# EAGLE design Led ControllerV2fixed (EAGLE 9.4.2)
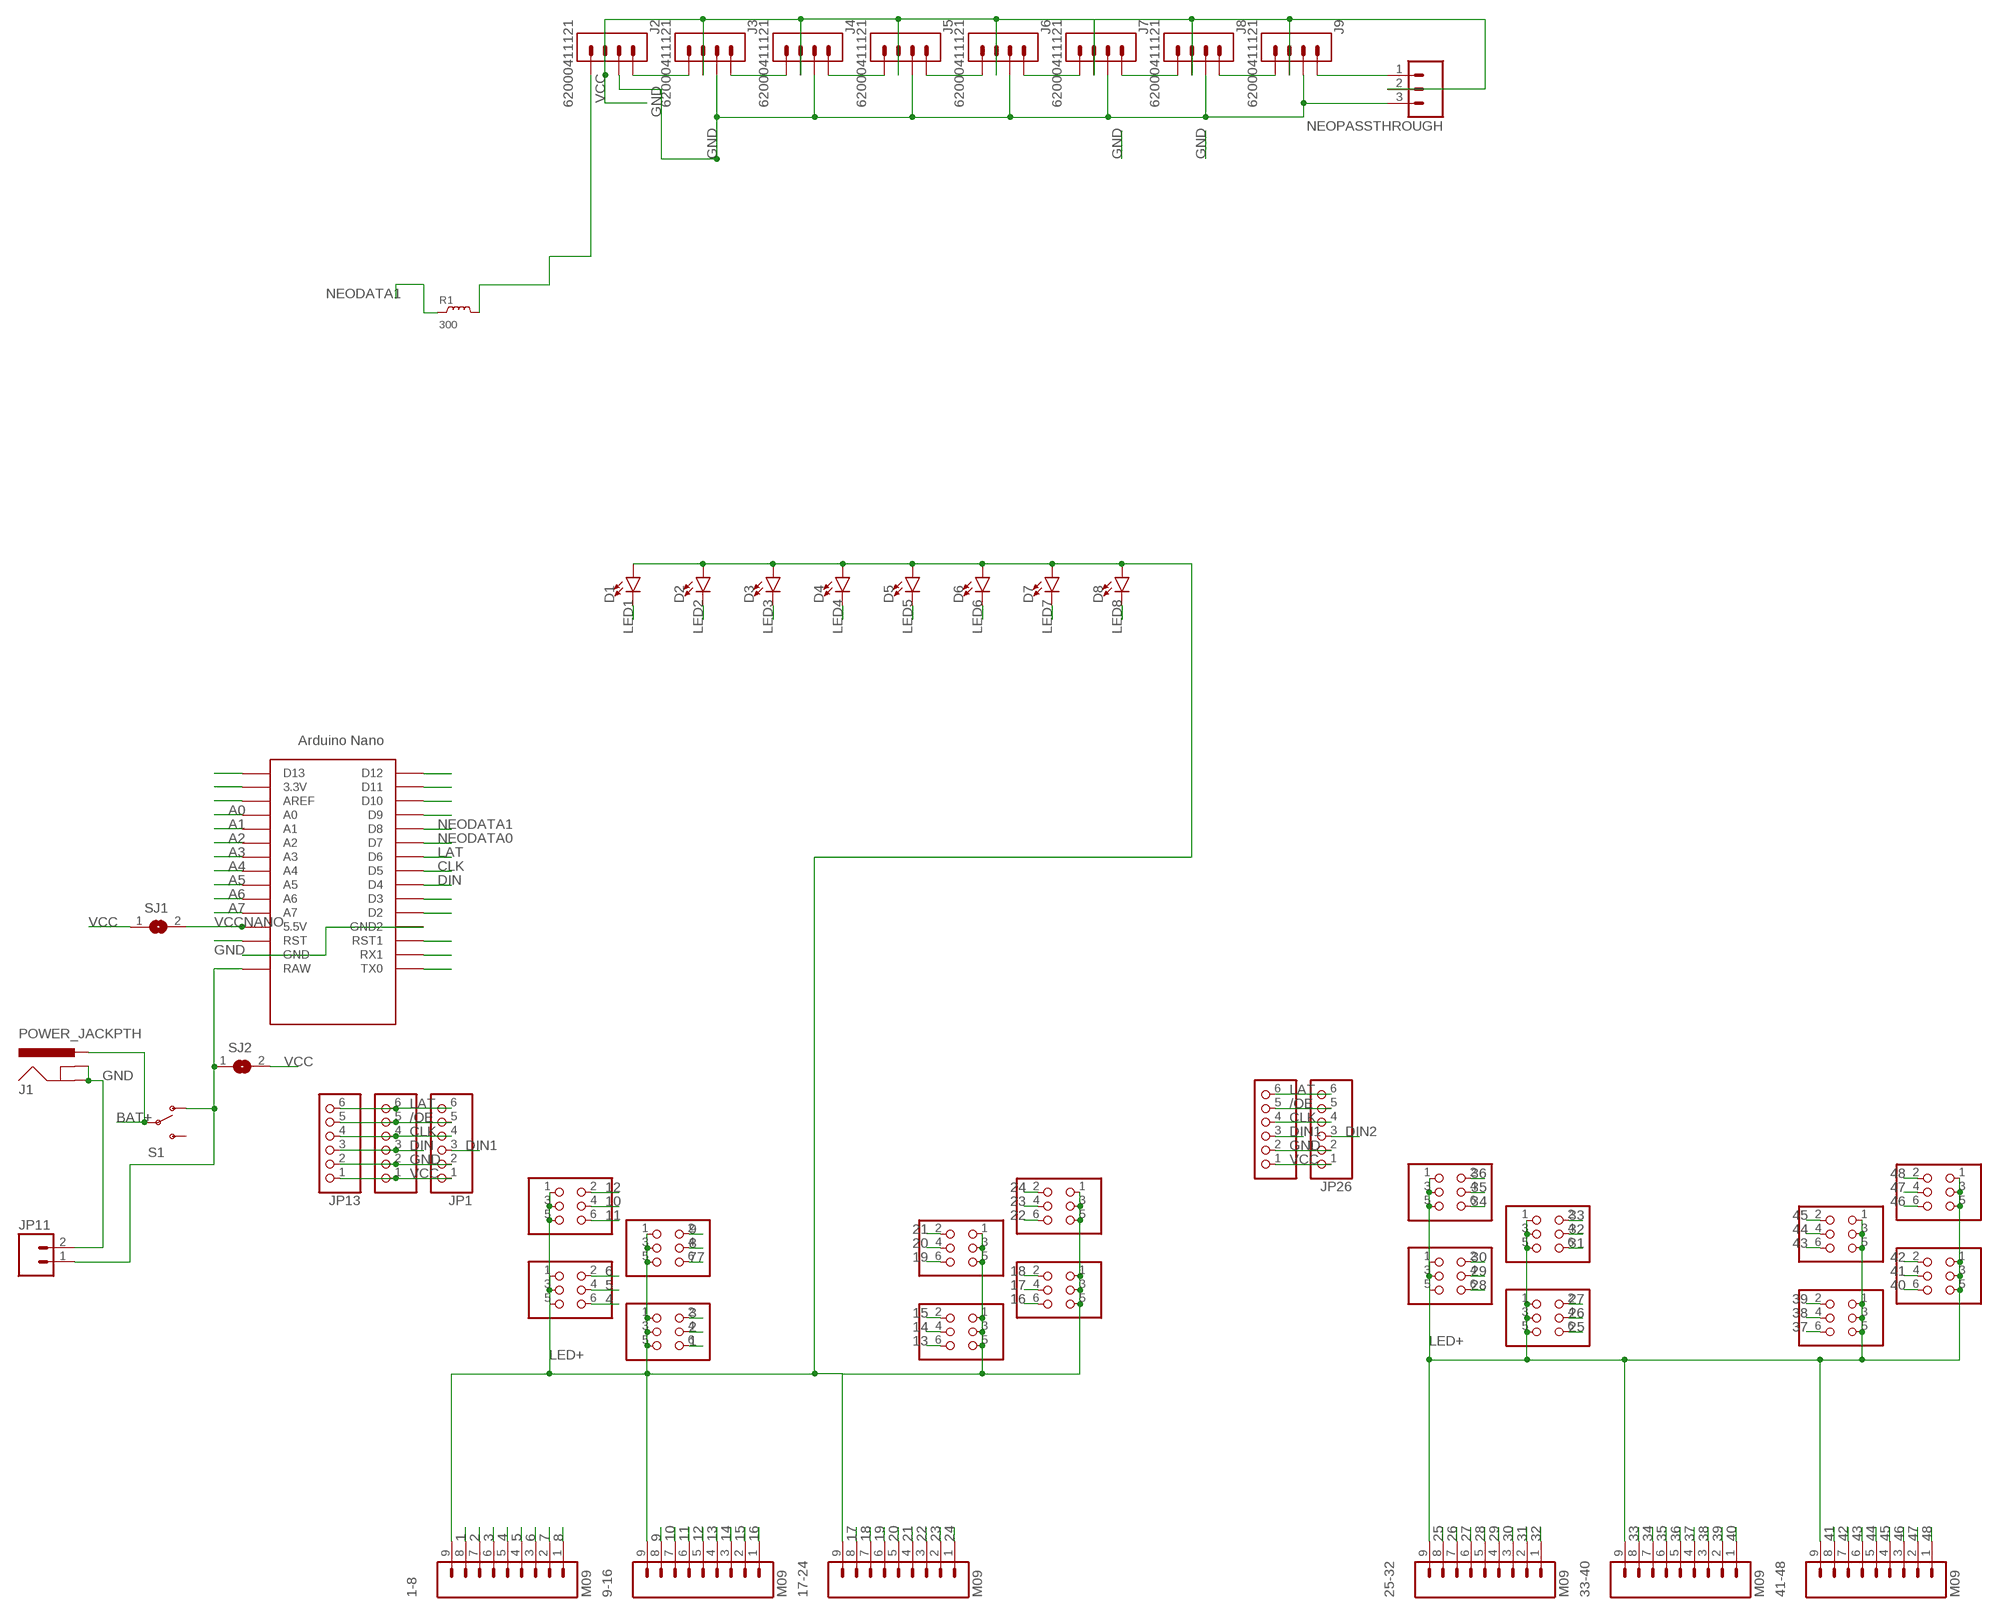
[diagram p0: schematic, sheet 1, part 1 of 2]
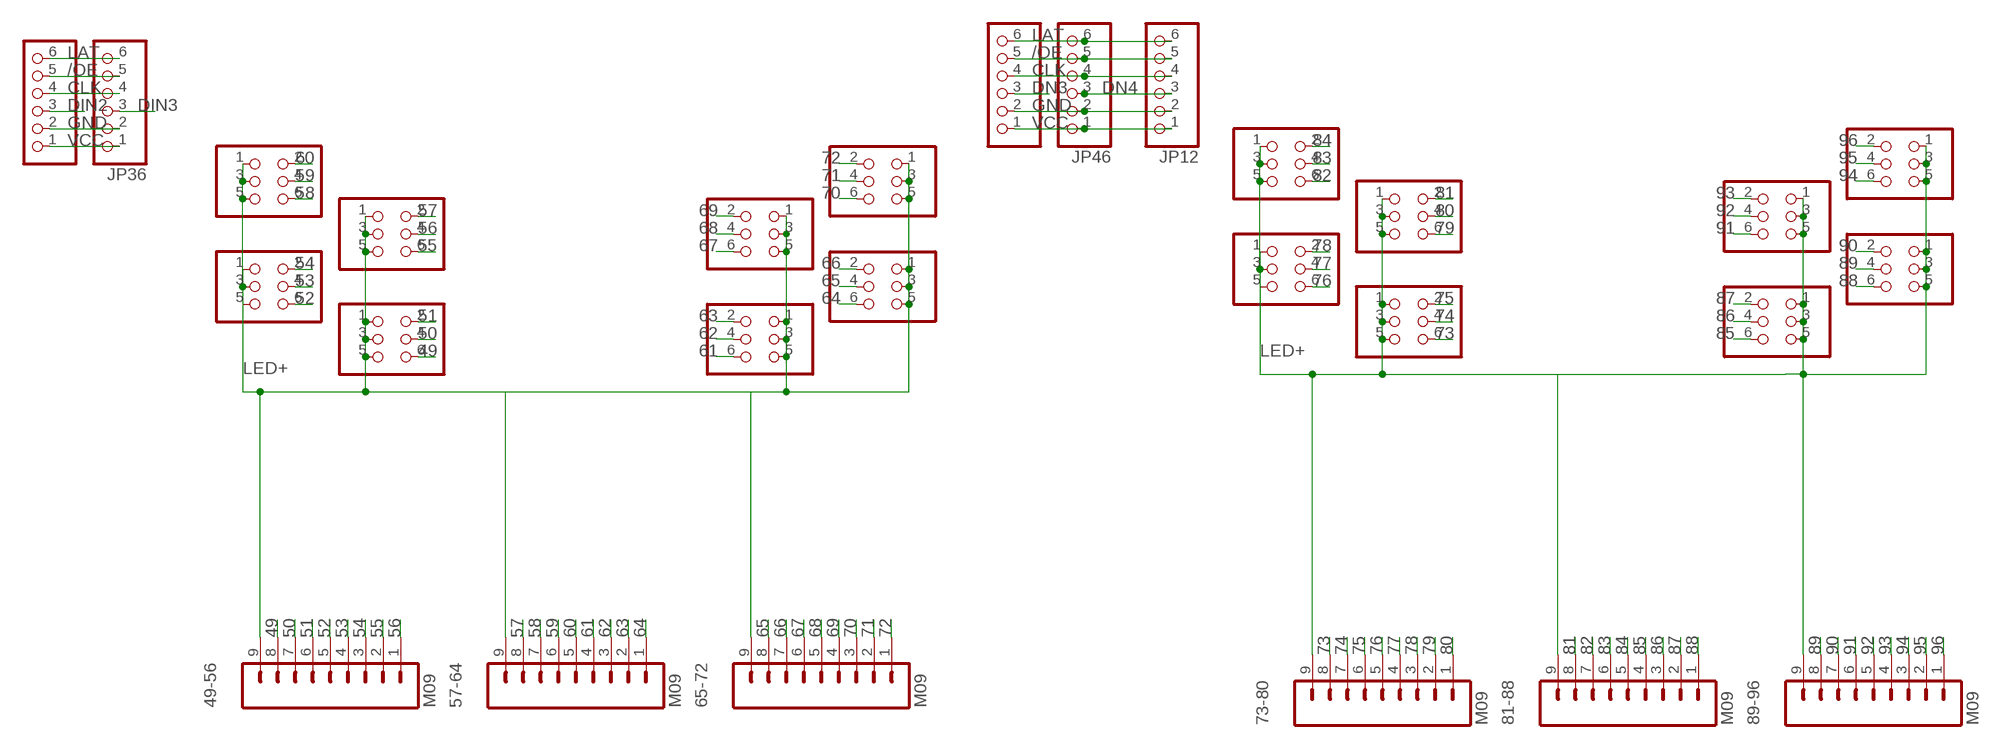
[diagram p1: schematic, sheet 1, part 2 of 2]

## Parts
1-8  M09  [1X09]
9-16  M09  [1X09]
17-24  M09  [1X09]
25-32  M09  [1X09]
33-40  M09  [1X09]
41-48  M09  [1X09]
49-56  M09  [1X09]
57-64  M09  [1X09]
65-72  M09  [1X09]
73-80  M09  [1X09]
81-88  M09  [1X09]
89-96  M09  [1X09]
D1  LED5MM  [LED_5MM]
D2  LED5MM  [LED_5MM]
D3  LED5MM  [LED_5MM]
D4  LED5MM  [LED_5MM]
D5  LED5MM  [LED_5MM]
D6  LED5MM  [LED_5MM]
D7  LED5MM  [LED_5MM]
D8  LED5MM  [LED_5MM]
J1  POWER_JACKPTH  [POWER_JACK_PTH]
J2  62000411121  [62000411121]
J3  62000411121  [62000411121]
J4  62000411121  [62000411121]
J5  62000411121  [62000411121]
J6  62000411121  [62000411121]
J7  62000411121  [62000411121]
J8  62000411121  [62000411121]
J9  62000411121  [62000411121]
JP1  INPUT  PINHD-1X6CB  [1X06-CLEANBIG]
JP2  HEADER-2X3  [2X03_ROUND_70MIL]
JP3  HEADER-2X3  [2X03_ROUND_70MIL]
JP4  HEADER-2X3  [2X03_ROUND_70MIL]
JP5  HEADER-2X3  [2X03_ROUND_70MIL]
JP6  HEADER-2X3  [2X03_ROUND_70MIL]
JP7  HEADER-2X3  [2X03_ROUND_70MIL]
JP8  HEADER-2X3  [2X03_ROUND_70MIL]
JP9  HEADER-2X3  [2X03_ROUND_70MIL]
JP10  OUTPUT  PINHD-1X6CB  [1X06-CLEANBIG]
JP11  M02POLAR  [MOLEX-1X2]
JP12  INPUT  PINHD-1X6CB  [1X06-CLEANBIG]
JP13  INPUT  PINHD-1X6CB  [1X06-CLEANBIG]
JP22  HEADER-2X3  [2X03_ROUND_70MIL]
JP23  HEADER-2X3  [2X03_ROUND_70MIL]
JP24  HEADER-2X3  [2X03_ROUND_70MIL]
JP25  HEADER-2X3  [2X03_ROUND_70MIL]
JP26  INPUT  PINHD-1X6CB  [1X06-CLEANBIG]
JP27  OUTPUT  PINHD-1X6CB  [1X06-CLEANBIG]
JP28  HEADER-2X3  [2X03_ROUND_70MIL]
JP29  HEADER-2X3  [2X03_ROUND_70MIL]
JP30  HEADER-2X3  [2X03_ROUND_70MIL]
JP31  HEADER-2X3  [2X03_ROUND_70MIL]
JP32  HEADER-2X3  [2X03_ROUND_70MIL]
JP33  HEADER-2X3  [2X03_ROUND_70MIL]
JP34  HEADER-2X3  [2X03_ROUND_70MIL]
JP35  HEADER-2X3  [2X03_ROUND_70MIL]
JP36  INPUT  PINHD-1X6CB  [1X06-CLEANBIG]
JP37  OUTPUT  PINHD-1X6CB  [1X06-CLEANBIG]
JP38  HEADER-2X3  [2X03_ROUND_70MIL]
JP39  HEADER-2X3  [2X03_ROUND_70MIL]
JP40  HEADER-2X3  [2X03_ROUND_70MIL]
JP41  HEADER-2X3  [2X03_ROUND_70MIL]
JP42  HEADER-2X3  [2X03_ROUND_70MIL]
JP43  HEADER-2X3  [2X03_ROUND_70MIL]
JP44  HEADER-2X3  [2X03_ROUND_70MIL]
JP45  HEADER-2X3  [2X03_ROUND_70MIL]
JP46  INPUT  PINHD-1X6CB  [1X06-CLEANBIG]
JP47  OUTPUT  PINHD-1X6CB  [1X06-CLEANBIG]
JP48  HEADER-2X3  [2X03_ROUND_70MIL]
JP49  HEADER-2X3  [2X03_ROUND_70MIL]
JP50  HEADER-2X3  [2X03_ROUND_70MIL]
JP51  HEADER-2X3  [2X03_ROUND_70MIL]
NEOPASSTHROUGH  M03PTH  [1X03]
R1  300  COIL-AXL-REGULAR  [AXL-REGULAR]
S1  SWITCH-SPSTPTH  [SWITCH-SPDT]
SJ1  JUMPER  [SJW]
SJ2  JUMPER  [SJW]
U$1  NANO  [NANO]

## Nets
1: 1-8.8 JP5.6
2: 1-8.7 JP5.4
3: 1-8.6 JP5.2
4: 1-8.5 JP4.6
5: 1-8.4 JP4.4
6: 1-8.3 JP4.2
7: 1-8.2
8: 1-8.1 JP3.4
9: 9-16.8 JP3.2
10: 9-16.7 JP2.4
11: 9-16.6 JP2.6
12: 9-16.5 JP2.2
13: 9-16.4 JP9.6
14: 9-16.3 JP9.4
15: 9-16.2 JP9.2
16: 9-16.1 JP8.6
17: 17-24.8 JP8.4
18: 17-24.7 JP8.2
19: 17-24.6 JP7.6
20: 17-24.5 JP7.4
21: 17-24.4 JP7.2
22: 17-24.3 JP6.6
23: 17-24.2 JP6.4
24: 17-24.1 JP6.2
25: 25-32.8 JP25.6
26: 25-32.7 JP25.4
27: 25-32.6 JP25.2
28: 25-32.5 JP24.6
29: 25-32.4 JP24.4
30: 25-32.3 JP24.2
31: 25-32.2 JP23.6
32: 25-32.1 JP23.4
33: 33-40.8 JP23.2
34: 33-40.7 JP22.6
35: 33-40.6 JP22.4
36: 33-40.5 JP22.2
37: 33-40.4 JP31.6
38: 33-40.3 JP31.4
39: 33-40.2 JP31.2
40: 33-40.1 JP30.6
41: 41-48.8 JP30.4
42: 41-48.7 JP30.2
43: 41-48.6 JP29.6
44: 41-48.5 JP29.4
45: 41-48.4 JP29.2
46: 41-48.3 JP28.6
47: 41-48.2 JP28.4
48: 41-48.1 JP28.2
49: 49-56.8 JP35.6
50: 49-56.7 JP35.4
51: 49-56.6 JP35.2
52: 49-56.5 JP34.6
53: 49-56.4 JP34.4
54: 49-56.3 JP34.2
55: 49-56.2 JP33.6
56: 49-56.1 JP33.4
57: 57-64.8 JP33.2
58: 57-64.7 JP32.6
59: 57-64.6 JP32.4
60: 57-64.5 JP32.2
61: 57-64.4 JP41.6
62: 57-64.3 JP41.4
63: 57-64.2 JP41.2
64: 57-64.1 JP40.6
65: 65-72.8 JP40.4
66: 65-72.7 JP40.2
67: 65-72.6 JP39.6
68: 65-72.5 JP39.4
69: 65-72.4 JP39.2
70: 65-72.3 JP38.6
71: 65-72.2 JP38.4
72: 65-72.1 JP38.2
73: 73-80.8 JP45.6
74: 73-80.7 JP45.4
75: 73-80.6 JP45.2
76: 73-80.5 JP44.6
77: 73-80.4 JP3.6 JP44.4
78: 73-80.3 JP44.2
79: 73-80.2 JP43.6
80: 73-80.1 JP43.4
81: 81-88.8 JP43.2
82: 81-88.7 JP42.6
83: 81-88.6 JP42.4
84: 81-88.5 JP42.2
85: 81-88.4 JP51.6
86: 81-88.3 JP51.4
87: 81-88.2 JP51.2
88: 81-88.1 JP50.6
89: 89-96.8 JP50.4
90: 89-96.7 JP50.2
91: 89-96.6 JP49.6
92: 89-96.5 JP49.4
93: 89-96.4 JP49.2
94: 89-96.3 JP48.6
95: 89-96.2 JP48.4
96: 89-96.1 JP48.2
/OE: JP1.5 JP10.5 JP12.5 JP13.5 JP26.5 JP27.5 JP36.5 JP37.5 JP46.5 JP47.5
A0: U$1.A0
A1: U$1.A1
A2: U$1.A2
A3: U$1.A3
A4: U$1.A4
A5: U$1.A5
A6: U$1.A6
A7: U$1.A7
BAT+: J1.PWR S1.2(P)
CLK: JP1.4 JP10.4 JP12.4 JP13.4 JP26.4 JP27.4 JP36.4 JP37.4 JP46.4 JP47.4 U$1.D5
DATAIN: J2.4 R1.2
DIN: JP10.3 JP13.3 U$1.D4
DIN1: JP1.3 JP27.3
DIN2: JP26.3 JP37.3
DIN3: JP36.3
DN3: JP47.3
DN4: JP12.3 JP46.3
GND: J1.GND J1.GNDBREAK J2.2 J3.2 J4.2 J5.2 J6.2 J7.2 J8.2 J9.2 JP1.2 JP10.2 JP11.2 JP12.2 JP13.2 JP26.2 JP27.2 JP36.2 JP37.2 JP46.2 JP47.2 NEOPASSTHROUGH.3 U$1.GND U$1.GND1(GND2)
LAT: JP1.6 JP10.6 JP12.6 JP13.6 JP26.6 JP27.6 JP36.6 JP37.6 JP46.6 JP47.6 U$1.D6
LED1: D1.K(C)
LED2: D2.K(C)
LED3: D3.K(C)
LED4: D4.K(C)
LED5: D5.K(C)
LED6: D6.K(C)
LED7: D7.K(C)
LED8: D8.K(C)
LED+: 1-8.9 9-16.9 17-24.9 25-32.9 33-40.9 41-48.9 49-56.9 57-64.9 65-72.9 73-80.9 81-88.9 89-96.9 D1.A D2.A D3.A D4.A D5.A D6.A D7.A D8.A JP2.1 JP2.3 JP2.5 JP3.1 JP3.3 JP3.5 JP4.1 JP4.3 JP4.5 JP5.1 JP5.3 JP5.5 JP6.1 JP6.3 JP6.5 JP7.1 JP7.3 JP7.5 JP8.1 JP8.3 JP8.5 JP9.1 JP9.3 JP9.5 JP22.1 JP22.3 JP22.5 JP23.1 JP23.3 JP23.5 JP24.1 JP24.3 JP24.5 JP25.1 JP25.3 JP25.5 JP28.1 JP28.3 JP28.5 JP29.1 JP29.3 JP29.5 JP30.1 JP30.3 JP30.5 JP31.1 JP31.3 JP31.5 JP32.1 JP32.3 JP32.5 JP33.1 JP33.3 JP33.5 JP34.1 JP34.3 JP34.5 JP35.1 JP35.3 JP35.5 JP38.1 JP38.3 JP38.5 JP39.1 JP39.3 JP39.5 JP40.1 JP40.3 JP40.5 JP41.1 JP41.3 JP41.5 JP42.1 JP42.3 JP42.5 JP43.1 JP43.3 JP43.5 JP44.1 JP44.3 JP44.5 JP45.1 JP45.3 JP45.5 JP48.1 JP48.3 JP48.5 JP49.1 JP49.3 JP49.5 JP50.1 JP50.3 JP50.5 JP51.1 JP51.3 JP51.5
N$1: JP11.1 S1.1(O) SJ2.1 U$1.RAW
N$2: U$1.RST
N$4: J9.1 NEOPASSTHROUGH.1
N$11: U$1.AREF
N$12: U$1.3.3V
N$13: U$1.D13
N$14: U$1.D12
N$15: U$1.D11
N$16: U$1.D10
N$17: U$1.D9
N$23: U$1.D3
N$24: U$1.D2
N$25: U$1.RST1
N$26: U$1.RX1
N$27: U$1.TX0
N$30: J2.1 J3.4
N$31: J3.1 J4.4
N$32: J4.1 J5.4
N$34: J5.1 J6.4
N$35: J6.1 J7.4
N$36: J7.1 J8.4
N$37: J8.1 J9.4
NEODATA0: U$1.D7
NEODATA1: R1.1 U$1.D8
VCC: J2.3 J3.3 J4.3 J5.3 J6.3 J7.3 J8.3 J9.3 JP1.1 JP10.1 JP12.1 JP13.1 JP26.1 JP27.1 JP36.1 JP37.1 JP46.1 JP47.1 NEOPASSTHROUGH.2 SJ1.1 SJ2.2
VCCNANO: SJ1.2 U$1.5V(5.5V)
Unconnected: S1.3(S) U$1.ICSP1 U$1.ICSP2 U$1.ICSP3 U$1.ICSP4 U$1.ICSP5 U$1.ICSP6

## Library data of the parts
1-8 9-16 17-24 25-32 33-40 41-48 49-56 57-64 65-72 73-80 81-88 89-96 = SparkFun:M09: Header 9 Standard 9-pin 0.1" header. Use with straight break away headers (SKU : PRT-00116), right angle break away headers (PRT-00553), swiss pins (PRT-00743), machine pins (PRT-00117), and female headers (PRT-00115).
D1-D8 = SparkFun-LED:LED: LED (Generic) Standard schematic elements and footprints for 5mm, 3mm, 1206, and 0603 sized LEDs. Generic LEDs with no color specified.
J1 = SparkFun:POWER_JACK: Power Jack This is the standard 5.5mm barrel jack for power. The PTH is the most common, proven, reliable, footprint. All others are experimental. The Slot footprint only works if the mill layer is transmitted to the PCB fab house so be warned. Spark Fun Electronics SKU : PRT-00119. Mating wall wart : TOL-00298 (and others); MPN: RAPC712BK; OC_NEWARK: 03M4244
J2-J9 = Headers:62000411121: THT Vertical Pin Header WR-PHD, Pitch 2.00 mm, Single Row, 4 pins Manufacturer's datasheet <https://datasheet.octopart.com/62000411121-W%C3%BCrth-Elektronik-datasheet-117282003.pdf>; CREATED_BY: PCBLayout.com; MANUFACTURER: Würth Elektronik; OC_NEWARK: unknown
JP1 JP10 JP12 JP13 JP26 JP27 JP36 JP37 JP46 JP47 = adafruit:PINHD-1X6: PIN HEADER; MPN: 1016; OC_NEWARK: 31Y5676
JP2-JP9 JP22-JP25 JP28-JP35 JP38-JP45 JP48-JP51 = microbuilder:HEADER-2X3: PIN HEADER; OC_NEWARK: unknown
JP11 = SparkFun:M02: Header 2 Standard 2-pin 0.1" header. Use with straight break away headers (SKU : PRT-00116), right angle break away headers (PRT-00553), swiss pins (PRT-00743), machine pins (PRT-00117), and female headers (PRT-00115). Molex polarized connector foot print use with SKU : PRT-08233 with associated crimp pins and housings.; MPN: 171856-0002; OC_NEWARK: 06X9806
NEOPASSTHROUGH = SparkFun:M03: Header 3 Standard 3-pin 0.1" header. Use with straight break away headers (SKU : PRT-00116), right angle break away headers (PRT-00553), swiss pins (PRT-00743), machine pins (PRT-00117), and female headers (PRT-00115). Molex polarized connector foot print use with SKU : PRT-08232 with associated crimp pins and housings.
R1 = FaBo-Coil:COIL: RESISTOR
S1 = SparkFun:SWITCH-SPST: SPST Switch Simple slide switch. Spark Fun Electronics SKU : COM-00102; MPN: 1825232-1; OC_NEWARK: 97X7939
SJ1 SJ2 = BaseApp:JUMPER
U$1 = Arduino-clone:NANO: Arduino Nano; OC_NEWARK: unknown

## Net classes
0 everything: width 0.254 mm

## Board
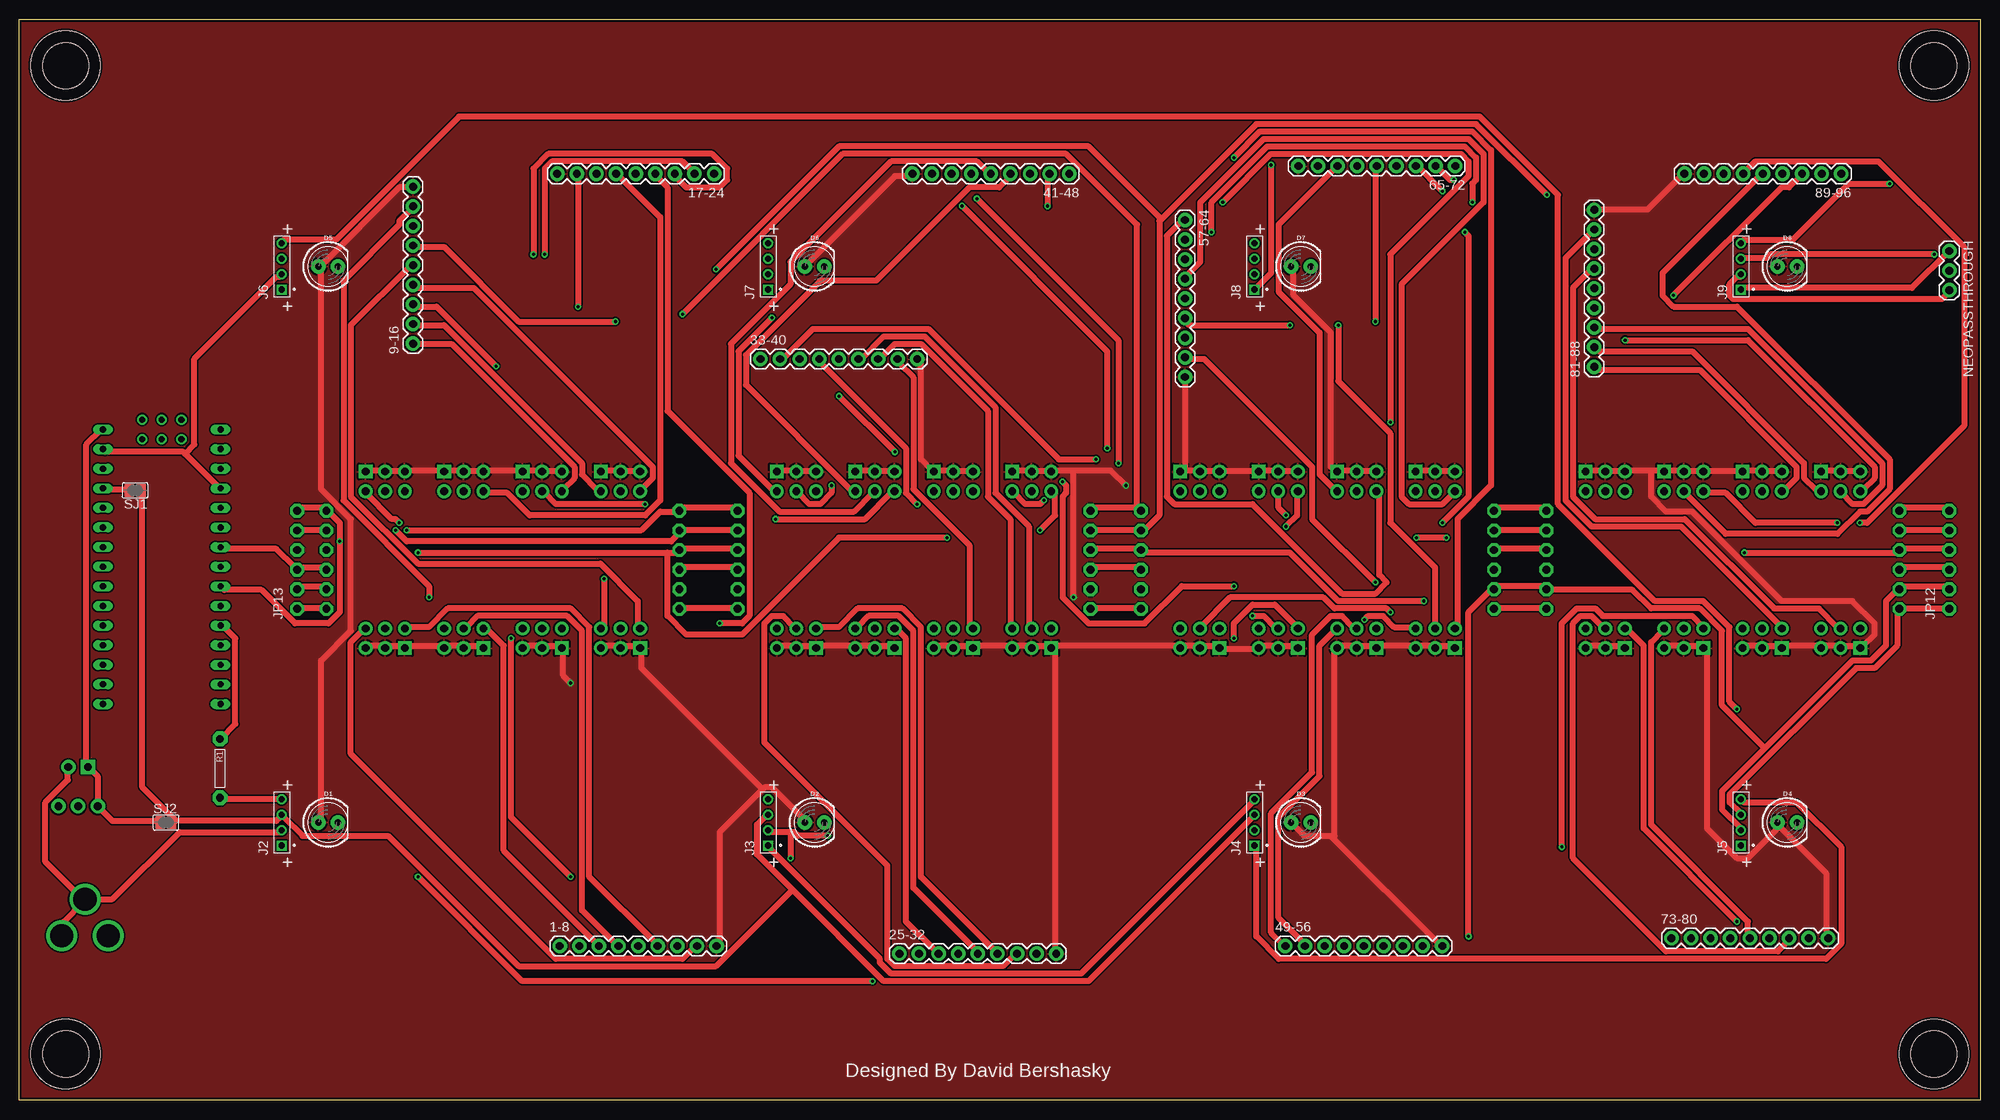
[diagram p2: board, top side]
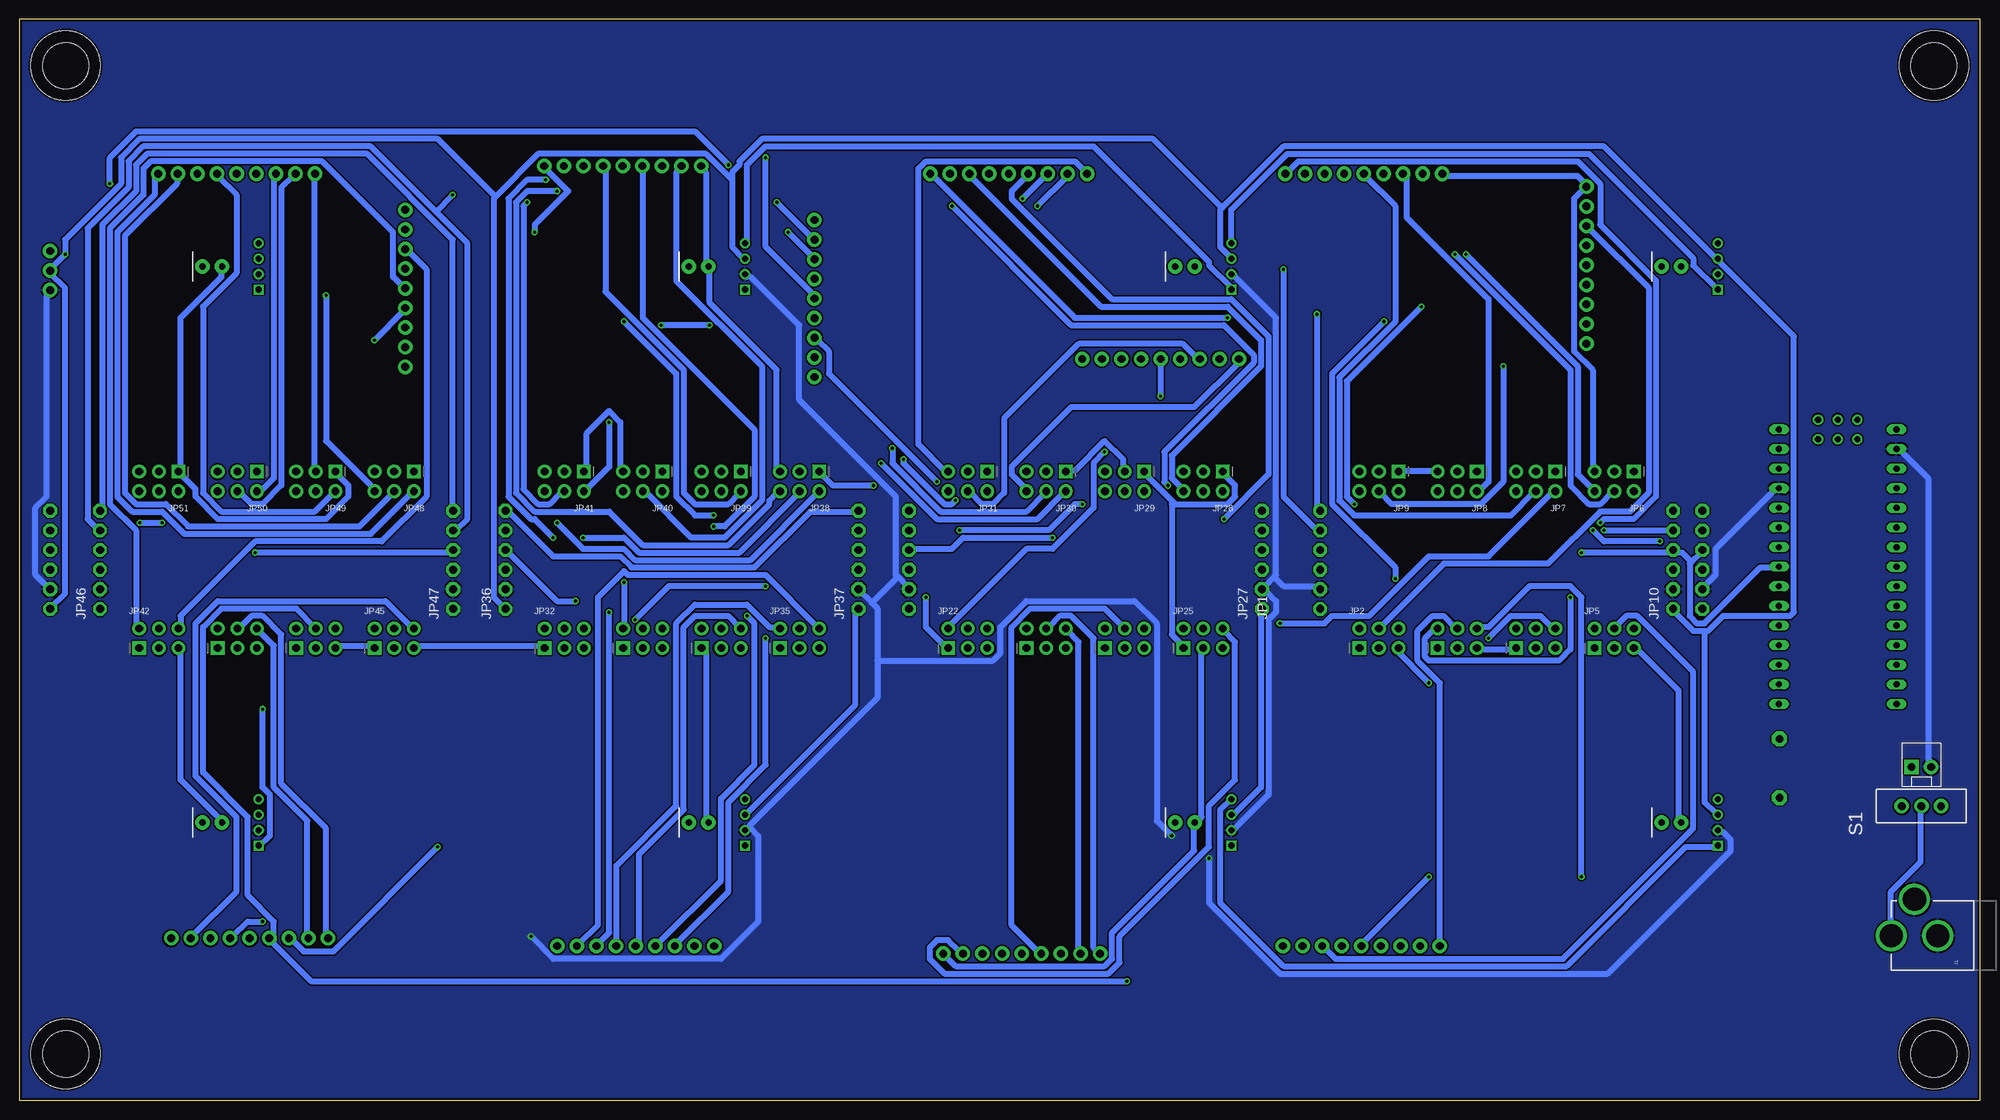
[diagram p3: board, bottom side, seen from below]

Size 254 x 140 mm. Coordinates in mm from the lower left corner, seen from the top.
Outline: 0,0 0,140 254,140 254,0 0,0
Copper layers (1*16): Top 0.035mm / dielectric 1.5mm / Bottom 0.035mm
Design rules "adafruit *": minimum track width 30mil, minimum drill 15.5mil, track to track 8mil, track to pad 8mil, pad to pad 8mil, via to via 8mil, smd to smd 8mil, copper to edge 10mil, drill to drill 8mil, minimum pad ring 10mil, minimum via ring 8mil, stop-mask expansion 4mil, vias tented up to drill 20mil, thermal gap 10mil
Holes 6 mm at 6,134 248,134 6,6 248,6
Holes 9 mm at 6,6 248,6 248,134 6,134

### Footprints (pad centres in the part's own frame; a part is rotated, then mirrored left to right if it is on the bottom)
1X09 = drill 1.016 pad 1.88: 1 0,0; 2 2.54,0; 3 5.08,0; 4 7.62,0; 5 10.16,0; 6 12.7,0; 7 15.24,0; 8 17.78,0; 9 20.32,0
LED_5MM = drill 0.813 pad 1.88: A -1.27,0; K 1.27,0
POWER_JACK_PTH = drill 2.997: GND 0,7.7; GNDBREAK 4.7,10.7; PWR 0,13.7
62000411121 = drill 0.8 square: 1 -3,0 | drill 0.8: 2 -1,0; 3 1,0; 4 3,0
1X06-CLEANBIG = drill 1.016 pad 1.778 octagon: 1 -6.35,0; 2 -3.81,0; 3 -1.27,0; 4 1.27,0; 5 3.81,0; 6 6.35,0
2X03_ROUND_70MIL = drill 1 pad 1.778 square: 1 -2.54,-1.27 | drill 1 pad 1.778: 2 -2.54,1.27; 3 0,-1.27; 4 0,1.27; 5 2.54,-1.27; 6 2.54,1.27
MOLEX-1X2 = drill 1.016 pad 1.88 square: 1 0,0 | drill 1.016 pad 1.88: 2 2.54,0
1X03 = drill 1.016 pad 1.88: 1 0,0; 2 2.54,0; 3 5.08,0
AXL-REGULAR = drill 1 pad 1.93 octagon: 1 -3.81,0; 2 3.81,0
SWITCH-SPDT = drill 1.016 pad 1.88: 1 0,2.54; 2 0,0; 3 0,-2.54
SJW = smd 1.168 x 1.6: 1 -0.762,0; 2 0.762,0
NANO = drill 0.8 long: 3.3V -10.16,24.13; 5V -10.16,-1.27; A0 -10.16,19.05; A1 -10.16,16.51; A2 -10.16,13.97; A3 -10.16,11.43; A4 -10.16,8.89; A5 -10.16,6.35; A6 -10.16,3.81; A7 -10.16,1.27; AREF -10.16,21.59; D2 5.08,1.27; D3 5.08,3.81; D4 5.08,6.35; D5 5.08,8.89; D6 5.08,11.43; D7 5.08,13.97; D8 5.08,16.51; D9 5.08,19.05; D10 5.08,21.59; D11 5.08,24.13; D12 5.08,26.67; D13 -10.16,26.67; GND -10.16,-6.35; GND1 5.08,-1.27; RAW -10.16,-8.89; RST -10.16,-3.81; RST1 5.08,-3.81; RX1 5.08,-6.35; TX0 5.08,-8.89 | drill 0.8: ICSP1 -5.08,-10.16; ICSP2 -5.08,-7.62; ICSP3 -2.54,-10.16; ICSP4 -2.54,-7.62; ICSP5 0,-10.16; ICSP6 0,-7.62

### Placement (x,y rotation side)
1-8  70,20 0 top
9-16  51,98 90 top
17-24  90,120 180 top
25-32  114,19 0 top
33-40  96,96 0 top
41-48  136,120 180 top
49-56  164,20 0 top
57-64  151,114 270 top
65-72  186,121 180 top
73-80  214,21 0 top
81-88  204,95 90 top
89-96  236,120 180 top
D1  40,36 0 top
D2  103,36 0 top
D3  166,36 0 top
D4  229,36 0 top
D5  40,108 0 top
D6  103,108 0 top
D7  166,108 0 top
D8  229,108 0 top
J1  -2.19,21.33 90 bottom
J2  34,36 90 top
J3  97,36 90 top
J4  160,36 90 top
J5  223,36 90 top
J6  34,108 90 top
J7  97,108 90 top
J8  160,108 90 top
J9  223,108 90 top
JP1  85.5,70 90 bottom
JP2  77.88,59.84 0 bottom
JP3  67.72,59.84 0 bottom
JP4  57.56,59.84 0 bottom
JP5  47.4,59.84 0 bottom
JP6  47.4,80.16 180 bottom
JP7  57.56,80.16 180 bottom
JP8  67.72,80.16 180 bottom
JP9  77.88,80.16 180 bottom
JP10  39.78,70 90 bottom
JP11  8.89,43.18 0 bottom
JP12  250,70 90 top
JP13  36,70 90 top
JP22  131.14,59.84 0 bottom
JP23  120.98,59.84 0 bottom
JP24  110.82,59.84 0 bottom
JP25  100.66,59.84 0 bottom
JP26  138.76,70 90 bottom
JP27  93.04,70 90 bottom
JP28  100.66,80.16 180 bottom
JP29  110.82,80.16 180 bottom
JP30  120.98,80.16 180 bottom
JP31  131.14,80.16 180 bottom
JP32  183.4,59.84 0 bottom
JP33  173.24,59.84 0 bottom
JP34  163.08,59.84 0 bottom
JP35  152.92,59.84 0 bottom
JP36  191.02,70 90 bottom
JP37  145.3,70 90 bottom
JP38  152.92,80.16 180 bottom
JP39  163.08,80.16 180 bottom
JP40  173.24,80.16 180 bottom
JP41  183.4,80.16 180 bottom
JP42  235.92,59.84 0 bottom
JP43  225.76,59.84 0 bottom
JP44  215.6,59.84 0 bottom
JP45  205.44,59.84 0 bottom
JP46  243.54,70 90 bottom
JP47  197.82,70 90 bottom
JP48  205.44,80.16 180 bottom
JP49  215.6,80.16 180 bottom
JP50  225.76,80.16 180 bottom
JP51  235.92,80.16 180 bottom
NEOPASSTHROUGH  250,110 270 top
R1  26,43 270 top
S1  7.62,38.1 90 bottom
SJ1  15,79 180 top
SJ2  19,36 0 top
U$1  21,78 180 bottom

### Tracks (layer width: path | path; a pad name or v marks a point on that pad's centre or on a via)
1
  Top 0.762: JP5.6 44.4,60.81 42.95,59.36 42.95,44.88 69.49,18.34 85.9,18.34 87.35,19.79 1-8.8
2
  Bottom 0.762: JP5.4 47.3,61.29 45.85,62.74 44.4,62.74 37.16,55.5 37.16,35.23 54.05,18.34 83.49,18.34 84.94,19.79 1-8.7
3
  Top 0.762: JP5.2 50.19,61.29 53.09,61.29 55.5,63.7 71.42,63.7 73.84,61.29 73.84,28.96 82.53,20.27 1-8.6
4  (via drill 0.39)
  Top 0.762: v63.7,59.84 63.7,36.68 v71.42,28.96
  Bottom 0.762: v63.7,59.84 60.81,62.74 56.95,62.74 55.5,61.29 JP4.6 | v71.42,28.96 80.11,20.27 1-8.5
5
  Top 0.762: JP4.4 57.91,61.29 59.36,62.74 70.94,62.74 72.87,60.81 72.87,24.61 77.22,20.27 1-8.4
6
  Top 0.762: JP4.2 60.33,60.81 60.81,60.81 62.74,58.88 62.74,32.33 74.8,20.27 1-8.3
8
  Bottom 0.762: JP3.4 68.05,61.29 69.49,62.74 70.94,62.74 72.87,60.81 72.87,56.95 69.98,54.05 69.98,20.27 1-8.1
9  (via drill 0.39)
  Top 0.762: v53.09,65.15 53.09,66.6 41.99,77.7 41.99,106.17 49.23,113.41 49.23,113.89 50.67,115.34 9-16.8
  Bottom 0.762: v53.09,65.15 53.09,58.4 54.53,56.95 71.42,56.95 71.91,57.43 71.91,59.84 70.94,60.81 70.46,60.81 JP3.2
10
  Bottom 0.762: JP2.4 77.7,61.29 69.49,69.49 55.98,69.49 49.23,76.25 45.36,76.25 42.95,78.66 42.95,105.21 50.67,112.93 9-16.7
11  (via drill 0.39)
  Top 0.762: v75.77,67.56 75.77,61.29 JP2.6 | v77.22,100.86 64.67,100.86 55.02,110.52 51.16,110.52 9-16.6
  Bottom 0.762: v75.77,67.56 75.77,69.01 83.97,77.22 83.97,94.11 v77.22,100.86
12
  Top 0.762: JP2.2 80.11,61.29 80.11,64.67 75.29,69.49 51.64,69.49 42.95,78.18 42.95,100.38 50.67,108.1 9-16.5
13
  Top 0.762: JP9.6 80.59,79.15 82.04,80.59 82.04,82.04 58.88,105.21 51.16,105.21 9-16.4
14  (via drill 0.39)
  Top 0.762: v61.77,95.07 54.05,102.79 51.16,102.79 9-16.3
  Bottom 0.762: v61.77,95.07 61.77,80.11 64.67,77.22 76.25,77.22 77.7,78.66 JP9.4
15
  Top 0.762: JP9.2 75.29,79.15 74.8,79.15 72.87,81.08 72.87,82.53 55.02,100.38 51.16,100.38 9-16.2
16
  Top 0.762: JP8.6 70.46,79.15 71.91,80.59 71.91,82.04 55.98,97.97 51.16,97.97 9-16.1
17  (via drill 0.39)
  Top 0.762: v81.08,77.22 69.49,77.22 68.05,78.66 JP8.4 | v72.39,102.79 72.39,119.69 17-24.8
  Bottom 0.762: v81.08,77.22 82.04,78.18 82.04,93.14 v72.39,102.79
18
  Bottom 0.762: JP8.2 65.15,79.15 64.67,79.15 63.7,80.11 63.7,103.76 74.32,114.38 74.32,119.69 17-24.7
19
  Top 0.762: JP7.6 60.33,78.66 63.22,78.66 66.12,75.77 81.08,75.77 83.01,77.7 83.01,114.38 77.7,119.69 17-24.6
20
  Bottom 0.762: JP7.4 57.91,78.66 60.81,75.77 81.08,75.77 83.01,77.7 83.01,93.62 75.77,100.86 75.77,115.82 79.63,119.69 17-24.5
21  (via drill 0.39)
  Top 0.762: v90.73,61.77 93.62,61.77 94.59,62.74 94.59,78.66 83.97,89.28 83.97,118.24 82.53,119.69 17-24.4
  Bottom 0.762: v90.73,61.77 84.94,61.77 83.97,62.74 79.15,62.74 71.42,70.46 63.7,70.46 55.5,78.66 JP7.2
22  (via drill 0.39)
  Top 0.762: v66.6,109.55 66.6,120.65 68.53,122.58 89.76,122.58 91.69,120.65 91.69,119.2 90.73,118.24 86.39,118.24 84.94,119.69 17-24.3
  Bottom 0.762: v66.6,109.55 52.12,95.07 52.12,81.08 50.19,79.15 JP6.6
23  (via drill 0.39)
  Top 0.762: v68.05,109.55 68.05,120.65 69.01,121.61 85.9,121.61 87.35,120.17 17-24.2
  Bottom 0.762: v68.05,109.55 53.09,94.59 53.09,79.63 50.67,77.22 49.23,77.22 47.78,78.66 JP6.4
24  (via drill 0.39)
  Top 0.762: v49.23,74.8 48.74,75.29 48.26,75.29 44.88,78.66 JP6.2
  Bottom 0.762: v49.23,74.8 48.74,75.29 44.88,75.29 41.99,78.18 41.99,106.17 49.23,113.41 49.23,118.72 52.12,121.61 88.32,121.61 89.76,120.17 17-24.1
25
  Bottom 0.762: JP25.6 97.97,60.81 96.52,59.36 96.52,41.5 99.9,38.12 99.9,32.82 111.48,21.23 111.48,17.86 112.93,16.41 134.16,16.41 136.09,18.34 136.09,19.79 135.13,20.75 133.68,20.75 132.23,19.3 25-32.8
26
  Top 0.762: JP25.4 100.38,61.29 98.93,62.74 97.48,62.74 96.52,61.77 96.52,46.33 112.45,30.4 112.45,18.34 113.41,17.37 127.41,17.37 128.85,18.82 25-32.7
27
  Top 0.762: JP25.2 103.28,61.29 106.17,61.29 108.58,63.7 114.38,63.7 116.79,61.29 116.79,28.96 126.44,19.3 25-32.6
28
  Top 0.762: JP24.6 108.58,61.29 110.03,62.74 113.89,62.74 115.82,60.81 115.82,27.51 124.03,19.3 25-32.5
29
  Bottom 0.762: JP24.4 111,61.29 113.41,63.7 123.06,63.7 125.48,61.29 125.48,22.68 122.1,19.3 25-32.4
30
  Top 0.762: JP24.2 113.41,60.81 113.89,60.81 114.86,59.84 114.86,23.16 118.72,19.3 25-32.3
31
  Bottom 0.762: JP23.6 118.24,60.81 116.79,59.36 116.79,19.3 25-32.2
32
  Bottom 0.762: JP23.4 120.65,61.29 119.2,62.74 117.75,62.74 114.86,59.84 114.86,19.79 114.38,19.3 25-32.1
33
  Top 0.762: JP23.2 123.06,61.29 123.06,71.91 115.82,79.15 115.82,93.62 113.89,95.56 33-40.8
34
  Top 0.762: JP22.6 128.37,61.29 128.37,75.29 125.48,78.18 125.48,89.28 116.79,97.97 113.41,97.97 111.48,96.04 33-40.7
35
  Top 0.762: JP22.4 130.78,61.29 130.78,74.32 126.44,78.66 126.44,89.76 117.27,98.93 111.96,98.93 109.07,96.04 33-40.6
36  (via drill 0.39)
  Top 0.762: v106.17,91.21 v113.41,83.97
  Bottom 0.762: v113.41,83.97 114.86,82.53 114.86,76.73 120.17,71.42 123.55,71.42 133.68,61.29 JP22.2 | v106.17,91.21 106.17,95.56 33-40.5
37  (via drill 0.39)
  Top 0.762: v132.23,73.84 134.16,75.77 134.16,78.66 JP31.6 | v116.31,77.22 114.86,78.66 114.86,84.45 103.76,95.56 33-40.4
  Bottom 0.762: v132.23,73.84 120.65,73.84 117.27,77.22 v116.31,77.22
38
  Bottom 0.762: JP31.4 130.78,78.66 129.34,77.22 127.89,77.22 126.44,78.66 126.44,88.32 116.79,97.97 103.28,97.97 101.35,96.04 33-40.3
39  (via drill 0.39)
  Top 0.762: v132.72,77.7 132.23,77.22 130.3,77.22 128.85,78.66 JP31.2 | v139.47,83.01 134.65,83.01 117.75,99.9 102.79,99.9 98.93,96.04 33-40.2
  Bottom 0.762: v132.72,77.7 133.2,77.22 134.16,77.22 139.47,82.53 v139.47,83.01
40
  Bottom 0.762: JP30.6 123.55,79.15 125.48,81.08 125.48,82.04 117.75,89.76 101.83,89.76 96.04,95.56 33-40.1
41  (via drill 0.39)
  Top 0.762: v140.92,84.45 140.92,97 v122.1,115.82
  Bottom 0.762: v140.92,84.45 140.92,82.53 134.65,76.25 123.55,76.25 121.13,78.66 JP30.4 | v122.1,115.82 118.24,119.69 41-48.8
42  (via drill 0.39)
  Top 0.762: v142.37,82.53 142.37,98.45 v124.03,116.79
  Bottom 0.762: v142.37,82.53 135.13,75.29 122.1,75.29 118.72,78.66 JP30.2 | v124.03,116.79 121.13,119.69 41-48.7
43  (via drill 0.39)
  Top 0.762: v97.97,75.29 109.55,75.29 112.93,78.66 JP29.6
  Bottom 0.762: v97.97,75.29 92.18,81.08 92.18,98.93 97,103.76 112.45,103.76 125.48,116.79 125.48,117.75 123.55,119.69 41-48.6
44
  Top 0.762: JP29.4 110.52,78.66 108.1,76.25 98.45,76.25 92.18,82.53 92.18,97.97 99.9,105.69 99.9,108.58 112.93,121.61 124.03,121.61 125.48,120.17 41-48.5
45
  Top 0.762: JP29.2 108.1,79.15 107.62,79.15 94.11,92.66 94.11,96.52 103.76,106.17 111,106.17 123.06,118.24 126.92,118.24 128.37,119.69 41-48.4
46
  Bottom 0.762: JP28.6 103.28,79.15 104.72,80.59 104.72,83.49 93.14,95.07 93.14,98.45 97.48,102.79 113.89,102.79 130.78,119.69 41-48.3
47  (via drill 0.39)
  Top 0.762: v105.21,79.63 105.21,78.66 103.76,77.22 102.31,77.22 100.86,78.66 JP28.4 | v133.2,115.82 133.2,119.69 41-48.2
  Bottom 0.762: v105.21,79.63 105.69,80.11 105.69,83.97 94.11,95.56 94.11,96.52 97.97,100.38 117.75,100.38 v133.2,115.82
48  (via drill 0.39)
  Top 0.762: v97.48,101.35 93.14,97 93.14,83.49 97.48,79.15 97.97,79.15 JP28.2
  Bottom 0.762: v97.48,101.35 117.27,101.35 135.61,119.69 41-48.1
49
  Bottom 0.762: JP35.6 150.57,61.29 157.33,68.05 175.18,68.05 175.67,68.53 179.04,65.15 179.04,22.68 181.46,20.27 49-56.8
50  (via drill 0.39)
  Top 0.762: v177.6,63.22 177.11,63.7 170.36,63.7 168.91,65.15 156.84,65.15 152.98,61.29 JP35.4
  Bottom 0.762: v177.6,63.22 177.6,21.72 179.04,20.27 49-56.7
51
  Bottom 0.762: JP35.2 155.88,61.29 156.84,61.29 159.74,64.19 166.5,64.19 168.91,61.77 168.91,38.12 176.63,30.4 176.63,20.27 49-56.6
52
  Bottom 0.762: JP34.6 160.71,61.29 162.15,62.74 166.5,62.74 167.94,61.29 167.94,37.64 173.74,31.85 173.74,20.27 49-56.5
53  (via drill 0.39)
  Top 0.762: v159.74,62.74 161.19,62.74 162.64,61.29 JP34.4
  Bottom 0.762: v159.74,62.74 158.78,61.77 158.78,43.43 163.12,39.09 163.12,28.47 171.32,20.27 49-56.4
54  (via drill 0.39)
  Top 0.762: v157.33,59.84 157.33,61.77 159.74,64.19 162.64,64.19 165.53,61.29 JP34.2
  Bottom 0.762: v157.33,59.84 157.33,43.43 162.15,38.61 162.15,27.03 168.91,20.27 49-56.3
55
  Top 0.762: JP33.6 170.36,60.81 168.43,58.88 168.43,41.99 163.12,36.68 163.12,23.65 166.5,20.27 49-56.2
56
  Top 0.762: JP33.4 172.77,61.29 171.32,62.74 169.88,62.74 167.46,60.33 167.46,42.47 162.15,37.16 162.15,21.72 163.6,20.27 49-56.1
57  (via drill 0.39)
  Top 0.762: v175.67,67.08 167.46,75.29 167.46,82.04 153.47,96.04 151.05,96.04 57-64.8
  Bottom 0.762: v175.67,67.08 175.67,61.29 JP33.2
58  (via drill 0.39)
  Top 0.762: v174.22,62.26 174.7,62.74 176.63,62.74 178.08,61.29 180.49,61.29 JP32.6 | v157.33,66.6 150.57,66.6 145.75,61.77 138.51,61.77 135.13,65.15 135.13,78.18 135.61,78.66 135.61,79.63 v135.13,80.11
  Bottom 0.762: v174.22,62.26 169.88,66.6 v157.33,66.6 | v135.13,80.11 149.12,94.11 149.12,97 150.57,98.45 57-64.7
59  (via drill 0.39)
  Top 0.762: v170.84,100.38 170.84,93.14 177.6,86.39 177.6,74.8 183.39,69.01 183.39,61.29 JP32.4 | v164.57,100.38 151.54,100.38 151.05,100.86 57-64.6
  Bottom 0.762: v164.57,100.38 v170.84,100.38
60  (via drill 0.39)
  Top 0.762: v157.33,122.1 160.71,125.48 188.21,125.48 190.63,123.06 190.63,79.63 186.28,75.29 186.28,61.29 JP32.2
  Bottom 0.762: v157.33,122.1 157.33,110.52 151.05,104.24 57-64.5
61
  Top 0.762: JP41.6 185.8,78.66 184.35,77.22 180.01,77.22 179.04,78.18 179.04,105.69 189.66,116.31 189.66,122.58 187.73,124.51 161.19,124.51 152.98,116.31 152.98,108.58 151.05,106.66 57-64.4
62  (via drill 0.39)
  Top 0.762: v188.21,116.31 188.21,118.72 188.7,119.2 188.7,122.1 187.25,123.55 161.67,123.55 154.43,116.31 v154.43,112.45
  Bottom 0.762: v188.21,116.31 188.7,115.82 188.7,79.15 186.77,77.22 185.32,77.22 183.87,78.66 JP41.4 | v154.43,112.45 151.05,109.07 57-64.3
63  (via drill 0.39)
  Top 0.762: v177.6,87.83 177.6,109.55 187.73,119.69 187.73,121.61 186.77,122.58 162.15,122.58 v155.88,116.31
  Bottom 0.762: v177.6,87.83 177.6,82.04 180.49,79.15 JP41.2 | v155.88,116.31 151.05,111.48 57-64.2
64
  Top 0.762: JP40.6 176.15,78.66 176.15,68.05 177.11,67.08 175.67,65.63 171.32,65.63 159.74,77.22 149.61,77.22 148.64,78.18 148.64,111.96 150.57,113.89 57-64.1
65
  Bottom 0.762: JP40.4 172.77,78.66 166.98,72.87 162.64,72.87 157.81,77.7 157.81,95.07 168.91,106.17 168.91,120.17 168.43,120.65 65-72.8
66
  Top 0.762: JP40.2 170.36,79.15 168.43,81.08 168.43,99.42 163.12,104.72 163.12,113.41 170.36,120.65 65-72.7
67  (via drill 0.39)
  Top 0.762: v164.08,74.32 165.53,75.77 165.53,78.66 JP39.6
  Bottom 0.762: v164.08,74.32 162.64,74.32 158.78,78.18 158.78,86.87 173.25,101.35 173.25,120.65 65-72.6
68  (via drill 0.39)
  Top 0.762: v164.08,75.77 163.12,76.73 163.12,78.66 JP39.4 | v175.67,100.86 175.67,120.65 65-72.5
  Bottom 0.762: v164.08,75.77 166.5,75.77 168.91,78.18 168.91,94.11 v175.67,100.86
69
  Bottom 0.762: JP39.2 160.71,78.66 162.15,77.22 166.5,77.22 167.94,78.66 167.94,94.59 178.08,104.72 178.08,120.65 65-72.4
70  (via drill 0.39)
  Top 0.762: v184.35,117.75 180.97,121.13 65-72.3
  Bottom 0.762: v184.35,117.75 188.21,117.75 189.66,116.31 189.66,78.66 187.25,76.25 177.6,76.25 173.25,71.91 162.15,71.91 156.84,77.22 156.84,77.7 155.88,78.66 JP38.6
71  (via drill 0.39)
  Top 0.762: v184.84,72.87 v180.97,72.87 | v185.8,119.2 185.32,119.2 183.87,120.65 65-72.2
  Bottom 0.762: v180.97,72.87 175.67,72.87 173.74,70.94 160.71,70.94 152.98,78.66 JP38.4 | v184.84,72.87 187.25,75.29 187.73,75.29 190.63,78.18 190.63,116.79 188.21,119.2 v185.8,119.2
72  (via drill 0.39)
  Top 0.762: v184.35,74.8 187.73,78.18 187.73,111.96 v187.25,112.45
  Bottom 0.762: v184.35,74.8 180.97,71.42 175.67,71.42 174.22,69.98 159.26,69.98 150.57,78.66 JP38.2 | v187.25,112.45 187.25,113.41 182.91,117.75 185.8,120.65 65-72.1
73
  Bottom 0.762: JP45.6 203.18,61.29 206.55,64.67 228.27,64.67 231.16,61.77 231.16,41.99 225.86,36.68 225.86,27.03 231.65,21.23 73-80.8
74
  Top 0.762: JP45.4 205.1,61.29 203.66,62.74 202.21,62.74 201.24,61.77 201.24,31.37 213.31,19.3 227.79,19.3 229.24,20.75 73-80.7
75  (via drill 0.39)
  Top 0.762: v222.48,23.16 210.41,35.23 210.41,58.88 208.48,60.81 208,60.81 JP45.2
  Bottom 0.762: v222.48,23.16 224.41,23.16 226.34,21.23 73-80.6
76
  Top 0.762: JP44.6 212.83,60.81 211.38,59.36 211.38,35.71 223.93,23.16 223.93,21.23 73-80.5
77  (via drill 0.39)
  Top 0.762: v51.64,28.96 65.15,15.44 v110.52,15.44
  Bottom 0.762: v51.64,28.96 51.64,65.15 53.09,66.6 58.4,66.6 63.7,61.29 65.15,61.29 JP3.6 | v110.52,15.44 216.21,15.44 221.51,20.75 73-80.4 221.03,20.75 221.03,23.16 224.41,26.54 224.41,36.68 230.2,42.47 230.2,61.29 227.79,63.7 218.13,63.7 215.72,61.29 JP44.4
78  (via drill 0.39)
  Top 0.762: v199.8,32.82 199.8,61.77 201.73,63.7 204.14,63.7 205.1,62.74 216.69,62.74 218.13,61.29 JP44.2
  Bottom 0.762: v199.8,32.82 213.31,19.3 217.17,19.3 218.62,20.75 73-80.3
79
  Bottom 0.762: JP43.6 222.96,60.81 221.03,58.88 221.03,40.54 216.69,36.2 216.69,21.23 73-80.2
80
  Bottom 0.762: JP43.4 225.37,61.29 223.93,62.74 222.48,62.74 220.07,60.33 220.07,41.02 214.27,35.23 214.27,21.23 73-80.1
81
  Top 0.762: JP43.2 228.27,61.29 215.24,74.32 203.66,74.32 200.28,77.7 200.28,109.07 203.66,112.45 81-88.8
82
  Bottom 0.762: JP42.6 233.1,61.29 233.1,62.74 223.44,72.39 207.03,72.39 201.24,78.18 201.24,107.62 203.66,110.03 81-88.7
83
  Top 0.762: JP42.4 235.51,61.29 233.1,63.7 227.31,63.7 215.72,75.29 204.14,75.29 201.24,78.18 201.24,105.21 203.66,107.62 81-88.6
84
  Bottom 0.762: JP42.2 238.89,61.29 238.89,73.84 242.26,77.22 242.26,112.93 237.92,117.27 237.92,120.65 236.96,121.61 214.76,121.61 205.59,112.45 205.59,106.66 204.14,105.21 81-88.5
85  (via drill 0.39)
  Top 0.762: v208,98.45 223.93,98.45 240.34,82.04 240.34,80.59 238.89,79.15 JP51.6
  Bottom 0.762: v208,98.45 204.14,102.31 81-88.4
86
  Top 0.762: JP51.4 235.99,78.66 237.44,77.22 238.89,77.22 241.3,79.63 241.3,82.53 223.93,99.9 204.14,99.9 81-88.3
87
  Top 0.762: JP51.2 233.1,79.15 232.61,79.15 231.16,80.59 231.16,82.53 216.69,97 204.62,97 204.14,97.48 81-88.2
88
  Top 0.762: JP50.6 228.75,79.15 230.2,80.59 230.2,82.04 217.65,94.59 204.14,94.59 81-88.1
89
  Bottom 0.762: JP50.4 225.37,78.66 223.93,77.22 222.48,77.22 220.07,79.63 220.07,118.24 218.62,119.69 89-96.8
90
  Bottom 0.762: JP50.2 222.96,79.15 222.48,79.15 221.03,80.59 221.03,119.69 89-96.7
91  (via drill 0.39)
  Top 0.762: v235.51,74.8 224.89,74.8 221.03,78.66 218.62,78.66 JP49.6 | v238.4,74.8 239.37,74.8 251.92,87.35 251.92,110.52 240.82,121.61 224.89,121.61 223.44,120.17 89-96.6
  Bottom 0.762: v238.4,74.8 v235.51,74.8
92
  Top 0.762: JP49.4 215.72,78.66 221.03,73.36 235.51,73.36 238.4,76.25 239.37,76.25 242.26,79.15 242.26,83.01 222.48,102.79 214.27,102.79 212.83,104.24 212.83,107.14 225.37,119.69 89-96.5
93
  Bottom 0.762: JP49.2 213.31,78.66 215.72,76.25 227.79,76.25 230.2,78.66 230.2,102.79 225.86,107.14 225.86,117.27 228.27,119.69 89-96.4
94  (via drill 0.39)
  Top 0.762: v214.27,104.24 228.27,118.24 229.24,118.24 230.68,119.69 89-96.3
  Bottom 0.762: v214.27,104.24 214.27,85.42 208,79.15 JP48.6
95
  Bottom 0.762: JP48.4 205.59,78.66 209.93,74.32 232.13,74.32 235.03,77.22 238.89,77.22 240.34,78.66 240.34,111.96 233.58,118.72 233.58,119.69 89-96.2
96
  Bottom 0.762: JP48.2 203.18,78.66 208.48,73.36 232.61,73.36 235.51,76.25 239.37,76.25 241.3,78.18 241.3,112.45 236.47,117.27 236.47,119.69 89-96.1
/OE  (via drill 0.39)
  Top 0.762: JP13.5 36.2,73.84 39.57,73.84 JP10.5 | JP27.5 92.66,73.84 85.9,73.84 JP1.5 85.42,73.36 84.45,72.39 50.19,72.39 v48.74,73.84 | JP26.5 138.99,73.84 145.26,73.84 JP37.5 145.75,73.84 147.68,75.77 147.68,113.89 147.92,114.14 | JP46.5 243.71,73.84 249.99,73.84 JP12.5 | JP36.5 191.11,73.84 197.38,73.84 JP47.5 | 147.92,114.14 160.22,126.44 188.7,126.44 v197.87,117.27 | v90.25,107.62 106.17,123.55 138.51,123.55 147.92,114.14
  Bottom 0.762: v48.74,73.84 40.06,73.84 JP10.5 | 200.04,115.1 195.94,111 195.94,75.29 197.38,73.84 JP47.5 | 200.04,115.1 208.48,123.55 237.92,123.55 239.85,121.61 239.85,118.24 245.16,112.93 245.16,75.29 243.71,73.84 JP46.5 | 200.04,115.1 v197.87,117.27 | v90.25,107.62 90.25,78.18 85.9,73.84 JP1.5
BAT+
  Bottom 0.762: S1.2 7.72,37.64 7.72,30.89 11.58,27.03 11.58,21.72 J1.PWR
CLK  (via drill 0.39)
  Top 0.762: JP27.4 92.66,71.42 85.9,71.42 JP1.4 85.42,70.94 83.97,70.94 | v51.64,70.94 83.97,70.94 | JP26.4 138.99,71.42 145.26,71.42 JP37.4 145.75,70.94 164.57,70.94 170.84,64.67 v181.94,64.67 | JP12.4 249.99,71.42 243.71,71.42 JP46.4 243.23,70.94 v223.44,70.94 | JP36.4 191.11,71.42 197.38,71.42 JP47.4 | 83.97,70.94 83.97,62.74 86.39,60.33 93.62,60.33 106.17,72.87 v120.17,72.87
  Bottom 0.762: 37.4,69.74 36.2,70.94 JP13.4 | 37.4,69.74 37.64,69.49 37.64,62.74 36.68,61.77 35.71,61.77 28.47,69.01 26.54,69.01 U$1.D5 | 37.4,69.74 38.61,70.94 39.57,70.94 JP10.4 40.06,70.94 v51.64,70.94 | v223.44,70.94 197.87,70.94 JP47.4 | v181.94,64.67 184.35,64.67 190.63,70.94 JP36.4 | v120.17,72.87 131.75,72.87 133.2,71.42 138.51,71.42 JP26.4
DATAIN
  Top 0.762: J2.4 33.78,39.09 26.06,39.09 R1.2
DIN
  Top 0.762: U$1.D4 26.54,71.42 33.3,71.42 35.71,69.01 JP13.3 36.2,69.01 39.57,69.01 JP10.3
DIN1
  Top 0.762: JP1.3 85.9,69.01 92.66,69.01 JP27.3
DIN2
  Top 0.762: JP26.3 138.99,69.01 145.26,69.01 JP37.3
DN4
  Top 0.762: JP46.3 243.71,69.01 249.99,69.01 JP12.3
GND  (via drill 0.39)
  Top 0.762: J9.2 222.96,106.66 222.48,106.66 221.51,105.69 221.51,104.24 222,103.76 249.02,103.76 249.99,104.72 NEOPASSTHROUGH.3 | 226.1,45.61 237.44,56.95 239.85,56.95 241.78,58.88 241.78,64.67 243.23,66.12 JP46.2 243.71,66.6 249.99,66.6 JP12.2 | 226.1,45.61 220.55,40.06 220.55,37.64 222.96,35.23 J5.2 | 226.1,45.61 220.55,51.16 220.55,60.81 217.65,63.7 211.38,63.7 208.97,66.12 197.87,66.12 JP47.2 197.38,66.6 191.11,66.6 JP36.2 190.63,66.12 187.73,63.22 v187.73,21.23 | J2.2 33.78,34.75 20.75,34.75 12.06,26.06 8.69,26.06 J1.GNDBREAK | JP11.2 6.27,42.95 6.27,41.5 3.38,38.61 3.38,30.89 8.2,26.06 J1.GNDBREAK | J1.GND 5.79,21.72 5.79,23.16 8.2,25.58 J1.GNDBREAK | 21.48,83.73 26.06,79.15 U$1.GND1 | 21.48,83.73 21.23,83.97 11.1,83.97 U$1.GND | 21.48,83.73 22.68,84.94 22.68,96.04 33.3,106.66 33.78,106.66 J6.2 | JP10.2 39.57,66.6 36.2,66.6 JP13.2 | 99.9,34.75 100.38,34.75 100.86,34.27 v104.72,34.27 | 99.9,34.75 97,34.75 J3.2 | 99.9,34.75 v99.9,31.37
  Bottom 0.762: NEOPASSTHROUGH.3 250.47,104.72 250.47,78.18 251.92,76.73 251.92,68.05 250.47,66.6 JP12.2 | U$1.GND1 26.54,79.15 34.27,71.42 34.27,68.05 35.71,66.6 JP13.2 | JP11.2 6.76,43.43 6.76,80.59 10.62,84.45 U$1.GND | J3.2 96.52,35.23 92.18,39.57 92.18,62.26 91.21,63.22 91.21,64.67 92.66,66.12 JP27.2 92.66,66.6 91.45,67.81 | 91.45,67.81 91.21,68.05 91.21,101.35 96.52,106.66 J7.2 | 91.45,67.81 90.25,66.6 85.9,66.6 JP1.2 | 159.5,35.47 142.85,52.12 142.85,56.95 | 159.5,35.47 159.74,35.23 J4.2 | 142.85,56.95 142.85,63.7 143.57,64.43 | 143.57,64.43 145.26,66.12 JP37.2 | 140.19,67.81 138.99,66.6 JP26.2 | 140.19,67.81 140.44,68.05 140.44,78.18 152.98,90.73 152.98,100.38 159.26,106.66 159.74,106.66 J8.2 | 140.19,67.81 143.57,64.43 | v104.72,34.27 106.66,36.2 106.66,61.77 109.55,64.67 123.55,64.67 126.92,61.29 126.92,57.91 127.89,56.95 142.85,56.95 | v99.9,31.37 99.9,25.58 90.73,16.41 48.26,16.41 32.33,32.33 32.33,33.78 33.3,34.75 33.78,34.75 J2.2 | v187.73,21.23 184.84,18.34 163.12,18.34 158.29,23.16 158.29,34.27 159.5,35.47
  pour Bottom: 0,140 0,0 254,0 254,140
LAT  (via drill 0.39)
  Top 0.762: JP27.6 92.66,76.73 85.9,76.73 JP1.6 85.42,76.25 83.01,76.25 80.59,73.84 v50.19,73.84 | U$1.D6 26.54,66.12 31.37,66.12 35.71,61.77 40.06,61.77 41.5,63.22 v41.5,72.39 41.5,74.8 40.06,76.25 JP10.6 39.57,76.73 36.2,76.73 JP13.6 | 144.78,76.73 145.26,76.73 JP37.6 144.78,76.73 | 144.78,76.73 138.99,76.73 JP26.6 | JP46.6 243.71,76.73 249.99,76.73 JP12.6 | JP36.6 191.11,76.73 197.38,76.73 JP47.6 | v85.9,101.83 106.66,122.58 135.61,122.58 144.78,113.41 144.78,76.73
  Bottom 0.762: v50.19,73.84 48.74,72.39 v41.5,72.39 | JP46.6 243.23,76.73 243.23,113.41 238.89,117.75 238.89,121.13 237.44,122.58 208.97,122.58 197.87,111.48 197.87,76.73 JP47.6 | JP37.6 145.75,76.25 151.54,76.25 158.78,69.01 174.7,69.01 176.15,70.46 184.84,70.46 190.63,76.25 JP36.6 | v85.9,101.83 85.9,76.73 JP1.6
LED+  (via drill 0.39)
  Top 0.762: JP6.1 44.88,81.56 47.3,81.56 JP6.3 47.78,81.56 49.71,81.56 JP6.5 50.19,81.56 55.02,81.56 JP7.1 55.5,81.56 57.43,81.56 JP7.3 57.91,81.56 59.84,81.56 JP7.5 60.33,81.56 65.15,81.56 JP8.1 65.63,81.56 67.56,81.56 JP8.3 68.05,81.56 69.98,81.56 JP8.5 | JP9.1 75.77,81.56 77.7,81.56 JP9.3 78.18,81.56 80.11,81.56 JP9.5 | 9-16.9 50.67,118.24 49.23,118.24 39.09,108.1 D5.A 39.09,107.62 39.09,79.15 42.95,75.29 42.95,60.81 39.09,56.95 39.09,36.2 D1.A | JP30.5 123.06,81.56 121.13,81.56 JP30.3 120.65,81.56 118.72,81.56 JP30.1 118.24,81.56 116.79,83.01 116.79,95.56 33-40.9 | JP25.5 98.45,58.88 100.38,58.88 JP25.3 100.86,58.88 102.79,58.88 JP25.1 103.28,58.88 108.1,58.88 JP24.5 108.58,58.88 110.52,58.88 JP24.3 111,58.88 112.93,58.88 JP24.1 | JP28.1 98.45,81.56 100.38,81.56 JP28.3 100.86,81.56 102.79,81.56 JP28.5 | JP29.1 108.58,81.56 110.52,81.56 JP29.3 111,81.56 112.93,81.56 JP29.5 | JP4.1 59.84,58.88 57.91,58.88 JP4.3 57.43,58.88 55.5,58.88 JP4.5 55.02,58.88 50.19,58.88 JP5.1 49.71,58.88 47.78,58.88 JP5.3 47.3,58.88 44.88,58.88 JP5.5 | JP3.5 65.63,58.88 67.56,58.88 JP3.3 68.05,58.88 69.98,58.88 JP3.1 70.46,58.4 70.46,55.02 v71.42,54.05 | JP2.5 75.77,58.88 77.7,58.88 JP2.3 78.18,58.88 80.11,58.88 JP2.1 80.59,58.4 80.59,55.98 96.28,40.3 | 96.28,40.3 96.52,40.54 97.48,40.54 101.83,36.2 D2.A | 96.28,40.3 90.73,34.75 90.73,20.27 1-8.9 | JP40.5 175.67,81.56 173.25,81.56 JP40.3 172.77,81.56 170.84,81.56 JP40.1 170.36,81.56 169.88,82.04 169.88,99.42 165.05,104.24 165.05,107.62 D7.A | JP41.1 180.97,81.56 183.39,81.56 JP41.3 183.87,81.56 185.8,81.56 JP41.5
  Top 0.762: D6.A 101.83,108.1 113.41,119.69 115.34,119.69 41-48.9 | JP39.5 165.53,81.56 163.12,81.56 JP39.3 162.64,81.56 160.71,81.56 JP39.1 160.22,81.56 155.88,81.56 JP38.5 155.4,81.56 152.98,81.56 JP38.3 152.5,81.56 151.05,81.56 | JP31.1 128.85,81.56 130.78,81.56 JP31.3 131.27,81.56 133.68,81.56 JP31.5 134.16,81.56 136.58,81.56 | 151.05,81.56 150.57,81.56 JP38.1 151.05,81.56 | 151.05,81.56 151.05,93.62 57-64.9 | 136.58,81.56 141.4,81.56 v143.33,79.63 | JP51.1 233.58,81.56 235.51,81.56 JP51.3 235.99,81.56 238.4,81.56 JP51.5 | 81-88.9 204.14,115.34 210.9,115.34 215.24,119.69 89-96.9 | JP50.5 228.27,81.56 225.86,81.56 JP50.3 225.37,81.56 223.44,81.56 JP50.1 222.96,81.56 218.62,81.56 JP49.5 218.13,81.56 215.72,81.56 JP49.3 215.24,81.56 213.31,81.56 JP49.1 212.83,81.56 211.38,81.56 | JP48.1 203.18,81.56 205.1,81.56 JP48.3 205.59,81.56 207.52,81.56 JP48.5 208,81.56 211.38,81.56 | JP23.5 118.72,58.88 120.65,58.88 JP23.3 121.13,58.88 123.06,58.88 JP23.1 123.55,58.88 128.37,58.88 JP22.5 128.85,58.88 130.78,58.88 JP22.3 131.27,58.88 133.68,58.88 JP22.1 | 25-32.9 134.16,19.3 134.16,58.4 JP22.1 | JP43.5 223.44,58.88 225.37,58.88 JP43.3 225.86,58.88 228.27,58.88 JP43.1 228.75,58.88 233.1,58.88 JP42.5 233.58,58.88 235.51,58.88 JP42.3 235.99,58.88 238.4,58.88 JP42.1 238.89,58.88 240.34,60.33 240.34,61.77 237.44,64.67 228.27,64.67 216.69,76.25 213.31,76.25 211.38,78.18 211.38,81.56 | 73-80.9 234.06,21.23 234.06,29.44 227.79,35.71 D4.A 227.79,35.23 223.93,31.37 222.48,31.37 218.62,35.23 218.62,58.4 JP44.1 218.13,58.88 215.72,58.88 JP44.3 215.24,58.88 213.31,58.88 JP44.5
  Top 0.762: JP32.1 185.8,58.88 183.87,58.88 JP32.3 183.39,58.88 180.97,58.88 JP32.5 180.49,58.88 176.15,58.88 JP33.1 175.67,58.88 173.25,58.88 JP33.3 172.77,58.88 170.84,58.88 JP33.5 170.36,58.4 170.36,34.27 170.12,34.02 | JP45.5 203.18,58.88 205.1,58.88 JP45.3 205.59,58.88 207.52,58.88 JP45.1 | JP34.1 165.53,58.88 163.12,58.88 JP34.3 162.64,58.88 160.71,58.88 JP34.5 160.22,58.4 155.88,58.4 JP35.1 155.4,58.88 152.98,58.88 JP35.3 152.5,58.88 150.57,58.88 JP35.5 150.09,58.88 134.16,58.88 JP22.1 | 170.12,34.02 169.88,34.27 166.5,34.27 165.05,35.71 D3.A | 170.12,34.02 183.87,20.27 49-56.9 | v136.58,65.15 136.58,81.56
  Bottom 0.762: JP8.5 70.46,81.56 75.29,81.56 JP9.1 | 17-24.9 69.49,119.69 52.12,119.69 51.16,118.72 9-16.9 51.16,118.24 52.6,116.79 52.6,97 50.19,94.59 50.19,81.56 JP6.5 | 104.48,77.46 108.1,81.08 JP29.1 | 104.48,77.46 104.24,77.22 97.48,77.22 96.52,78.18 96.52,79.63 97.97,81.08 JP28.1 | JP25.1 103.28,58.88 104.72,60.33 104.72,77.22 104.48,77.46 | JP30.1 118.24,81.56 117.27,81.56 113.41,85.42 111,83.01 111,81.56 JP29.3 | JP4.1 60.33,58.4 65.15,58.4 JP3.5 | D1.A 39.09,36.2 39.09,53.09 44.4,58.4 JP5.5 | v71.42,54.05 75.77,58.4 JP2.5 | JP25.3 100.86,58.4 100.86,36.68 101.35,36.2 D2.A 101.83,35.71 101.83,32.33 112.45,21.72 112.45,18.34 113.41,17.37 132.72,17.37 134.16,18.82 25-32.9 | 65-72.9 165.53,120.65 165.05,120.17 165.05,108.1 D7.A 164.57,107.62 164.57,103.28 155.88,94.59 155.88,81.56 JP38.5 | JP40.5 176.15,81.56 176.15,87.83 177.6,89.28 180.49,86.39 180.49,81.56 JP41.1 | v143.33,79.63 148.64,79.63 150.09,81.08 JP38.1 | 41-48.9 115.82,120.17 117.27,121.61 136.58,121.61 137.54,120.65 137.54,84.94 134.16,81.56 JP31.5 | D8.A 227.79,107.62 227.79,106.66 233.1,101.35 233.1,81.56 JP51.1 233.1,81.08 231.16,79.15 231.16,78.18 228.27,75.29 214.27,75.29 211.38,78.18 211.38,79.63 212.83,81.08 JP49.1 | 89-96.9 215.72,119.69 215.72,81.56 JP49.3 | JP42.5 233.1,58.4 233.1,41.5 227.79,36.2 D4.A | JP45.1 208,58.88 212.83,58.88 JP44.5 | JP32.1 186.28,58.88 202.69,58.88 JP45.5 | D3.A 165.05,36.2 165.05,57.91 165.53,58.4 JP34.1 | v136.58,65.15 136.58,61.29 134.16,58.88 JP22.1
  pour Top: 0,140 0,0 254,0 254,140
N$1
  Top 0.762: SJ2.1 17.86,36.2 12.06,36.2 S1.1 10.13,38.12 10.13,41.99 9.17,42.95 JP11.1 8.69,43.43 8.69,84.94 10.62,86.87 U$1.RAW
N$4
  Top 0.762: J9.1 223.44,105.21 245.16,105.21 249.99,110.03 NEOPASSTHROUGH.1
N$30
  Bottom 0.762: J2.1 34.27,32.82 38.12,32.82 53.57,17.37 90.25,17.37 98.45,25.58 98.45,37.64 97,39.09 J3.4
N$31
  Top 0.762: J3.1 97,32.82 111.48,18.34 111.48,17.86 112.93,16.41 137.54,16.41 159.74,38.61 J4.4
N$32
  Top 0.762: J4.1 160.22,32.82 160.22,21.23 163.12,18.34 234.06,18.34 235.99,20.27 235.99,32.82 230.2,38.61 223.44,38.61 J5.4
N$34  (via drill 0.39)
  Top 0.762: v222.48,50.67 221.51,51.64 221.51,61.29 218.13,64.67 211.86,64.67 199.31,77.22 199.31,117.27 189.18,127.41 56.95,127.41 41.02,111.48 34.27,111.48 J6.4
  Bottom 0.762: v222.48,50.67 222.48,40.54 221.51,39.57 221.51,34.27 222.96,32.82 J5.1
N$35
  Bottom 0.762: J6.1 34.27,105.21 37.16,108.1 37.16,109.07 50.67,122.58 89.76,122.58 97,115.34 97,111.48 J7.4
N$36
  Bottom 0.762: J7.1 97,105.21 99.9,108.1 99.9,108.58 114.86,123.55 157.33,123.55 159.74,121.13 159.74,111.48 J8.4
N$37  (via drill 0.39)
  Top 0.762: v162.15,121.13 162.15,107.14 160.22,105.21 J8.1 | v242.26,118.72 236.96,118.72 229.72,111.48 223.44,111.48 J9.4
  Bottom 0.762: v162.15,121.13 166.5,125.48 238.89,125.48 242.26,122.1 v242.26,118.72
NEODATA1
  Top 0.762: U$1.D8 26.54,61.29 27.99,59.84 27.99,48.74 26.06,46.81 R1.1
VCC  (via drill 0.39)
  Top 0.762: JP1.1 85.9,63.7 92.66,63.7 JP27.1 | JP26.1 138.99,63.7 145.26,63.7 JP37.1 | 100.14,27.27 111.96,15.44 138.51,15.44 159.74,36.68 J4.3 | 100.14,27.27 95.56,31.85 95.56,35.71 96.52,36.68 J3.3 | v248.06,109.55 226.82,109.55 226.34,109.07 223.44,109.07 J9.3 | J5.3 222.96,37.16 221.51,38.61 221.51,39.57 237.92,55.98 240.34,55.98 243.23,58.88 243.23,63.22 JP46.1 243.71,63.7 249.99,63.7 JP12.1 | 20.27,36.2 33.3,36.2 33.78,36.68 J2.3 34.27,36.68 36.68,34.27 47.78,34.27 64.67,17.37 90.25,17.37 100.14,27.27 | 20.27,36.2 19.79,36.2 SJ2.2 20.27,36.2 | 20.27,36.2 15.93,40.54 15.93,78.66 SJ1.1 | JP36.1 191.11,63.7 197.38,63.7 JP47.1 | JP13.1 36.2,63.7 39.57,63.7 JP10.1
  Bottom 0.762: J3.3 96.52,37.16 93.14,40.54 93.14,63.22 JP27.1 | J4.3 159.74,37.16 145.75,51.16 145.75,63.22 JP37.1 | JP12.1 249.99,63.7 248.06,65.63 248.06,105.21 249.99,107.14 NEOPASSTHROUGH.2 249.99,107.62 v248.06,109.55 248.06,111.48 240.82,118.72 240.82,122.1 238.4,124.51 199.8,124.51 192.32,117.03 | 35.71,60.81 37.16,60.81 39.57,63.22 JP10.1 | 35.71,60.81 35.23,60.81 33.3,62.74 24.61,62.74 24.13,63.22 24.13,98.93 33.78,108.58 J6.3 34.27,109.07 48.74,123.55 90.25,123.55 98.21,115.58 | 98.21,115.58 98.45,115.34 98.45,110.52 97,109.07 J7.3 | 161.67,119.2 161.67,120.17 160.71,121.13 160.71,121.61 157.81,124.51 107.14,124.51 98.21,115.58 | 161.67,119.2 161.67,110.52 160.22,109.07 J8.3 | 192.32,117.03 186.77,122.58 165.05,122.58 161.67,119.2 | 192.32,117.03 192.56,116.79 192.56,65.15 191.11,63.7 JP36.1 | 35.71,60.81 35.71,38.61 34.27,37.16 J2.3
VCCNANO
  Top 0.762: SJ1.2 13.99,79.15 11.1,79.15 U$1.5V

### Text on the board
tNames: + | + | + | + | + | + | + | + | + | + | + | + | + | + | + | Designed By David Bershasky